# EAGLE design mippe_mod_test (EAGLE 9.5.2)
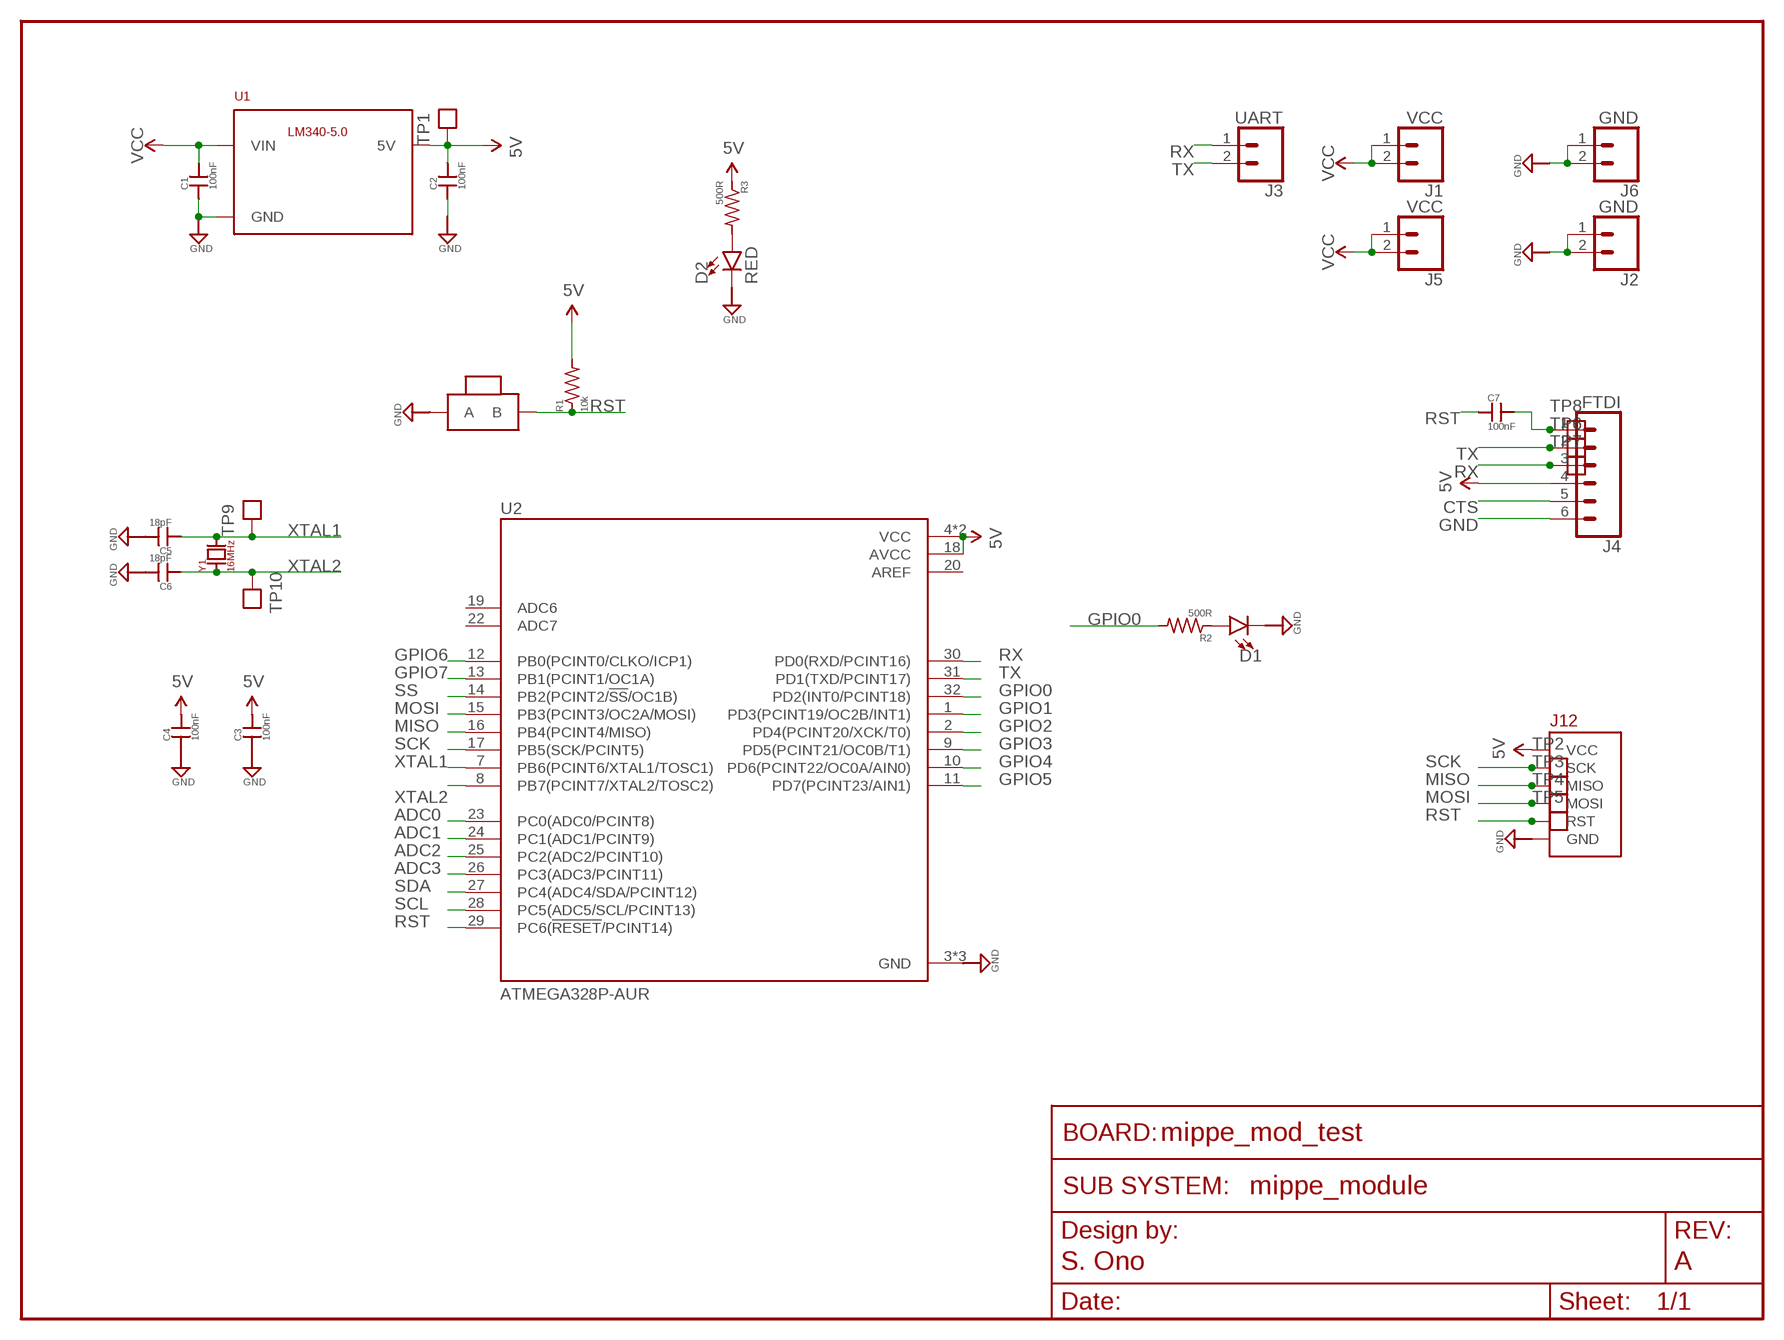
[diagram p0: schematic, sheet 1]
FRAME2 (FRAME_SCHEMATIC): AUTHOR: S. Ono; REV: A; SUBSYSTEM_NAME: mippe_module

## Parts
C1  100nF  CAP0402-CAP  [0402-CAP]
C2  100nF  CAP0402-CAP  [0402-CAP]
C3  100nF  CAP0402-CAP  [0402-CAP]
C4  100nF  CAP0402-CAP  [0402-CAP]
C5  18pF  CAP0402-CAP  [0402-CAP]
C6  18pF  CAP0402-CAP  [0402-CAP]
C7  100nF  CAP0402-CAP  [0402-CAP]
D1  LED0603  [LED-0603]
D2  RED  LED0603  [LED-0603]
J1  VCC  CONN_02  [1X02]
J2  GND  CONN_02  [1X02]
J3  UART  CONN_02  [1X02]
J4  FTDI  CONN_06NO_SILK_FEMALE_PTH  [1X06_NO_SILK]
J5  VCC  CONN_02  [1X02]
J6  GND  CONN_02  [1X02]
J12  BURNIN  [BURNIN]
R1  10k  R-US_R0402  [R0402]
R2  500R  R-US_R0402  [R0402]
R3  500R  R-US_R0402  [R0402]
SW1  BTN-PTS810  [BTN_PTS810]
TP1  TEST_POINTTHRU  [TEST_POINT]
TP2  TEST_POINTTHRU  [TEST_POINT]
TP3  TEST_POINTTHRU  [TEST_POINT]
TP4  TEST_POINTTHRU  [TEST_POINT]
TP5  TEST_POINTTHRU  [TEST_POINT]
TP6  TEST_POINTTHRU  [TEST_POINT]
TP7  TEST_POINTTHRU  [TEST_POINT]
TP8  TEST_POINTTHRU  [TEST_POINT]
TP9  TEST_POINTTHRU  [TEST_POINT]
TP10  TEST_POINTTHRU  [TEST_POINT]
U1  LM340MPX-5.0230  [SOT230P700X180-4N]
U2  ATMEGA328P-AUR  [QFP80P900X900X120-32N]
Y1  16MHz  CRYSTAL_SMOL  [XTAL500X320X130N]

## Nets
5V: C2.2 C3.2 C4.2 J4.4 J12.3.3V(VCC) R1.2 R3.1 TP1.1 U1.3(5V) U2.4(VCC) U2.6(VCC) U2.18(AVCC)
ADC0: U2.23(PC0(ADC0/PCINT8))
ADC1: U2.24(PC1(ADC1/PCINT9))
ADC2: U2.25(PC2(ADC2/PCINT10))
ADC3: U2.26(PC3(ADC3/PCINT11))
CTS: J4.5
GND: C1.1 C2.1 C3.1 C4.1 C5.2 C6.2 D1.C D2.C J2.1 J2.2 J4.6 J6.1 J6.2 J12.GND SW1.1(A) SW1.2(A) U1.2(GND) U1.4(GND) U2.3(GND) U2.5(GND) U2.21(GND)
GPIO0: R2.2 U2.32(PD2(INT0/PCINT18))
GPIO1: U2.1(PD3(PCINT19/OC2B/INT1))
GPIO2: U2.2(PD4(PCINT20/XCK/T0))
GPIO3: U2.9(PD5(PCINT21/OC0B/T1))
GPIO4: U2.10(PD6(PCINT22/OC0A/AIN0))
GPIO5: U2.11(PD7(PCINT23/AIN1))
GPIO6: U2.12(PB0(PCINT0/CLKO/ICP1))
GPIO7: U2.13(PB1(PCINT1/OC1A))
MISO: J12.MISO TP3.1 U2.16(PB4(PCINT4/MISO))
MOSI: J12.MOSI TP4.1 U2.15(PB3(PCINT3/OC2A/MOSI))
N$1: D1.A R2.1
N$2: D2.A R3.2
N$3: C7.2 J4.1 TP8.1
RST: C7.1 J12.RST R1.1 SW1.3(B) SW1.4(B) TP5.1 U2.29(PC6(!RESET!/PCINT14))
RX: J3.1 J4.3 TP7.1 U2.30(PD0(RXD/PCINT16))
SCK: J12.SCK TP2.1 U2.17(PB5(SCK/PCINT5))
SCL: U2.28(PC5(ADC5/SCL/PCINT13))
SDA: U2.27(PC4(ADC4/SDA/PCINT12))
SS: U2.14(PB2(PCINT2/!SS!/OC1B))
TX: J3.2 J4.2 TP6.1 U2.31(PD1(TXD/PCINT17))
VCC: C1.2 J1.1 J1.2 J5.1 J5.2 U1.1(VIN)
XTAL1: C5.1 TP9.1 U2.7(PB6(PCINT6/XTAL1/TOSC1)) Y1.2(B)
XTAL2: C6.1 TP10.1 U2.8(PB7(PCINT7/XTAL2/TOSC2)) Y1.1(A)
Unconnected: U2.19(ADC6) U2.22(ADC7)

## Power pins joined to a net without a drawn wire
AREF: U2.20(AREF)

## Library data of the parts
C1-C7 = scono:CAP: Capacitor Standard 0603 ceramic capacitor, and 0.1" leaded capacitor.; PIE-INT-REF-NUM: CAPACITOR-GENERIC
D1 D2 = scono:LED: https://www.digikey.com/products/en/optoelectronics/led-indication-discrete/105?k=&pkeyword=&pv7=2&pv1989=0&pv16=5&FV=ffe00069&quantity=0&ColumnSort=0&page=1&pageSize=25
J1-J3 J5 J6 = scono:CONN_02: Multi connection point. Often used as Generic Header-pin footprint for 0.1 inch spaced/style header connections On any of the 0.1 inch spaced packages, you can populate with these: Break Away Headers - Straight <https://www.sparkfun.com/products/116> (PRT-00116) Break Away Male Headers - Right Angle <https://www.sparkfun.com/products/553> (PRT-00553) Female Headers <https://www.sparkfun.com/products/115> (PRT-00115) Break Away Headers - Machine Pin <https://www.sparkfun.com/products/117> (PRT-00117) Break Away Female Headers - Swiss Machine Pin <https://www.sparkfun.com/products/743> (PRT-00743) For SCREWTERMINALS and SPRING TERMINALS visit here: Screw Terimnals on SparkFun.com <https://www.sparkfun.com/search/results?term=Screw+Terminals> (5mm/3.5mm/2.54mm spacing) This device is also useful as a general connection point to wire up your design to another part of your project. Our various solder wires solder well into these plated through hole pads. Hook-Up Wire - Assortment (Stranded, 22 AWG) <https://www.sparkfun.com/products/11375> (PRT-11375) Hook-Up Wire - Assortment (Solid Core, 22 AWG) <https://www.sparkfun.com/products/11367> (PRT-11367) View the entire wire category on our website here <https://www.sparkfun.com/categories/141> Special notes: Molex polarized connector foot print use with: PRT-08233 with associated crimp pins and housings. 2.54_SCREWTERM for use with PRT-10571. 3.5mm Screw Terminal footprints for PRT-08084 5mm Screw Terminal footprints for use with PRT-08432
J4 = scono:CONN_06: Multi connection point. Often used as Generic Header-pin footprint for 0.1 inch spaced/style header connections On any of the 0.1 inch spaced packages, you can populate with these: Break Away Headers - Straight <https://www.sparkfun.com/products/116> (PRT-00116) Break Away Male Headers - Right Angle <https://www.sparkfun.com/products/553> (PRT-00553) Female Headers <https://www.sparkfun.com/products/115> (PRT-00115) Break Away Headers - Machine Pin <https://www.sparkfun.com/products/117> (PRT-00117) Break Away Female Headers - Swiss Machine Pin <https://www.sparkfun.com/products/743> (PRT-00743) Arduino Stackable Header - 6 Pin <https://www.sparkfun.com/products/9280> (PRT-09280) For SCREWTERMINALS and SPRING TERMINALS visit here: Screw Terimnals on SparkFun.com <https://www.sparkfun.com/search/results?term=Screw+Terminals> (5mm/3.5mm/2.54mm spacing) This device is also useful as a general connection point to wire up your design to another part of your project. Our various solder wires solder well into these plated through hole pads. Hook-Up Wire - Assortment (Stranded, 22 AWG) <https://www.sparkfun.com/products/11375> (PRT-11375) Hook-Up Wire - Assortment (Solid Core, 22 AWG) <https://www.sparkfun.com/products/11367> (PRT-11367) View the entire wire category on our website here <https://www.sparkfun.com/categories/141>; PROD_ID: CONN-08437
J12 = scono:BURNIN
R1-R3 = scono:R-US_: RESISTOR, American symbol
SW1 = scono:BTN-PTS810: https://www.digikey.com/product-detail/en/c-k/PTS810-SJM-250-SMTR-LFS/CKN10502CT-ND/4176673
TP1-TP10 = scono:TEST_POINT: 1206 Test point for O-scope probes. For A106146CT-ND or similar
U1 = scono:LM340MPX-5.0
U2 = scono:ATMEGA328P-AUR: ATmega328P Series 8 Bit 2 kB RAM 32 kB Flash SMT Microcontroller - TQFP-32; DESCRIPTION: ATmega328P Series 8 Bit 2 kB RAM 32 kB Flash SMT Microcontroller - TQFP-32; DIGI-KEY_PART_NUMBER: ATMEGA328P-AURCT-ND; DIGI-KEY_PURCHASE_URL: https://www.digikey.com/product-detail/en/microchip-technology/ATMEGA328P-AUR/ATMEGA328P-AURCT-ND/3789455?utm_source=snapeda&utm_medium=aggregator&utm_campaign=symbol; MF: Microchip; MP: ATMEGA328P-AUR; PACKAGE: TQFP-32 Microchip
Y1 = scono:CRYSTAL

## Board
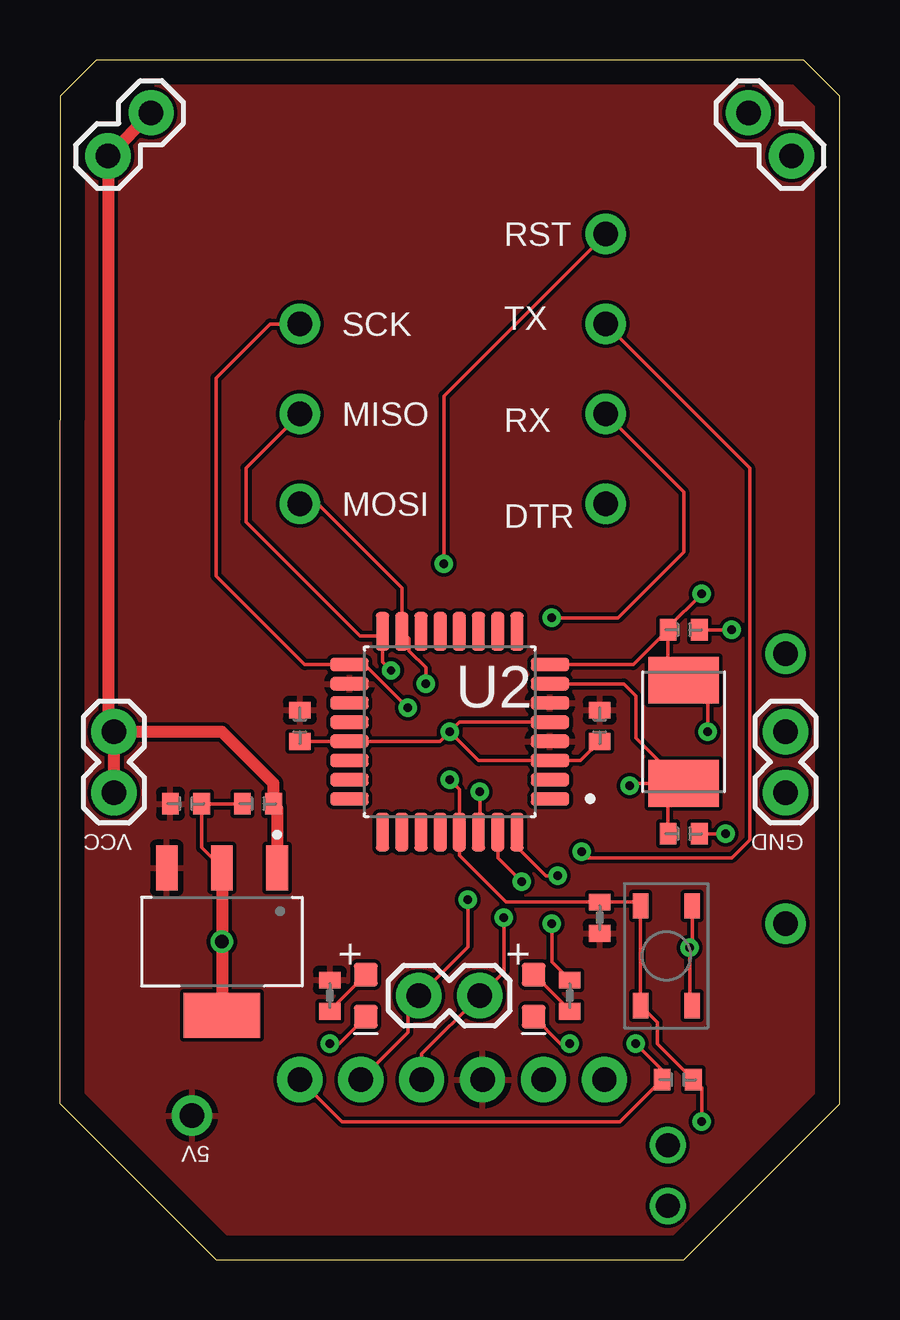
[diagram p1: board, top side]
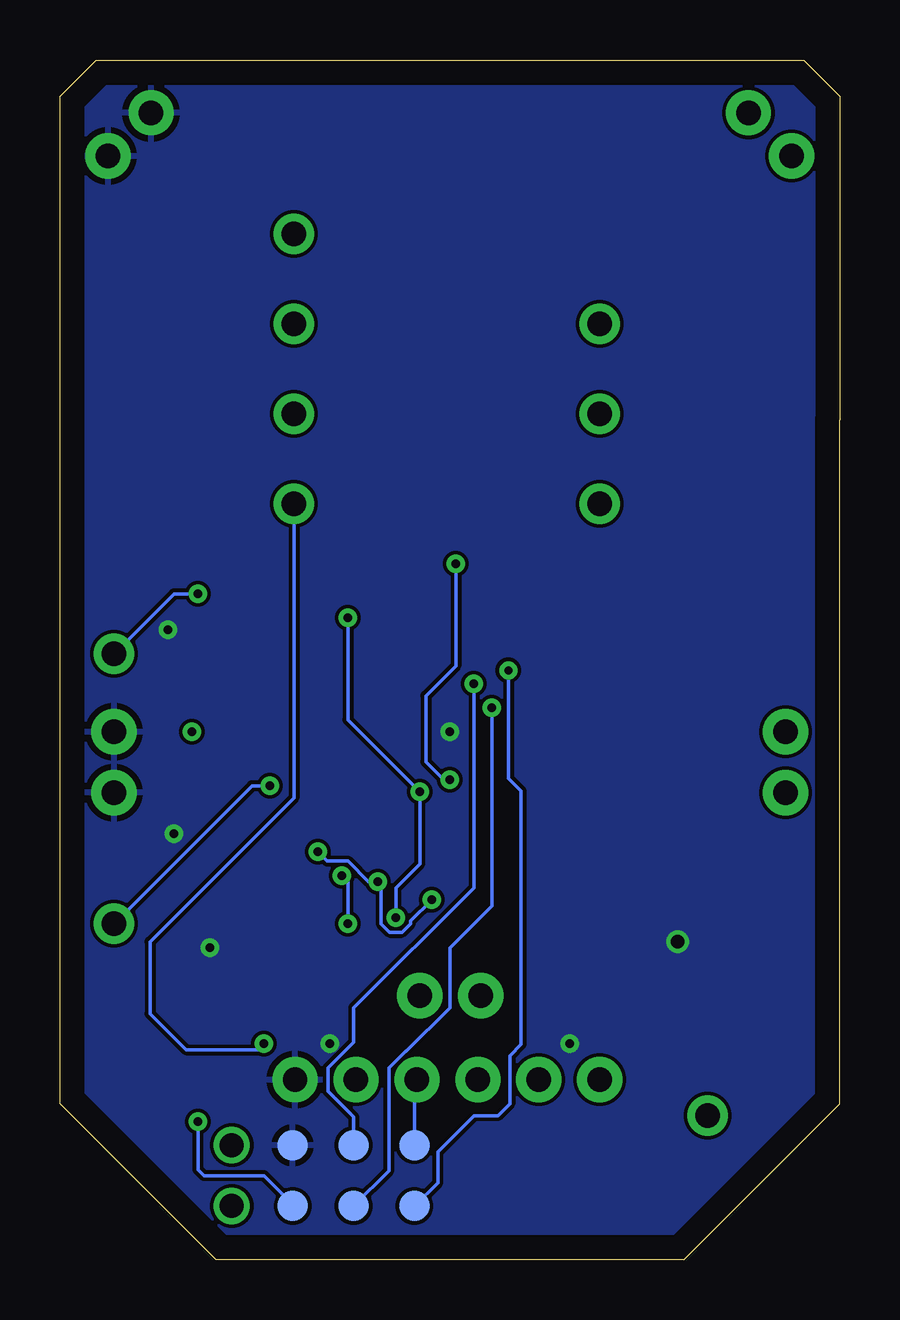
[diagram p2: board, bottom side, seen from below]

Size 32.5 x 50 mm. Coordinates in mm from the lower left corner, seen from the top.
Outline: 6.5,0 0,6.5 0,35 0,48.5 1.5,50 31,50 32.5,48.5 32.5,30.5 32.5,6.5 26,0 6.5,0
Copper layers (1*16): Top 0.035mm / dielectric 0.15mm / Bottom 0.035mm
Design rules "default": minimum track width 6mil, minimum drill 0.35mm, track to track 6mil, track to pad 6mil, pad to pad 6mil, via to via 6mil, smd to smd 6mil, copper to edge 40mil, drill to drill 6mil, minimum pad ring 10mil, minimum via ring 8mil, stop-mask expansion 4mil, vias tented up to drill 0mil, thermal gap 10mil

### Footprints (pad centres in the part's own frame; a part is rotated, then mirrored left to right if it is on the bottom)
0402-CAP = smd 0.7 x 0.9: 1 -0.65,0; 2 0.65,0
LED-0603 = smd 1 x 1: A 0.877,0; C -0.877,0
1X02 = drill 1.016 pad 1.88: 1 0,0; 2 2.54,0
1X06_NO_SILK = drill 1.016 pad 1.88: 1 0,0; 2 2.54,0; 3 5.08,0; 4 7.62,0; 5 10.16,0; 6 12.7,0
BURNIN = smd 1.27 x 1.27 bottom: 3.3V 0,0; GND -5.08,0; MISO 0,2.54; MOSI -2.54,0; RST -5.08,2.54; SCK -2.54,2.54 | drill 1: P$7 -7.62,2.54; P$8 -7.62,0
R0402 = smd 0.7 x 0.9: 1 -0.65,0; 2 0.65,0
BTN_PTS810 = smd 1.05 x 0.65: 1 -2.075,1.075; 2 2.075,1.075; 3 -2.075,-1.075; 4 2.075,-1.075
TEST_POINT = drill 1.016 pad 1.676: 1 0,0
SOT230P700X180-4N = smd 1.86 x 0.9: 1 -3.075,2.3; 2 -3.075,0; 3 -3.075,-2.3 | smd 1.86 x 3.19: 4 3.075,0
QFP80P900X900X120-32N = smd 1.6 x 0.55: 1 -4.18,2.8; 2 -4.18,2; 3 -4.18,1.2; 4 -4.18,0.4; 5 -4.18,-0.4; 6 -4.18,-1.2; 7 -4.18,-2; 8 -4.18,-2.8; 17 4.18,-2.8; 18 4.18,-2; 19 4.18,-1.2; 20 4.18,-0.4; 21 4.18,0.4; 22 4.18,1.2; 23 4.18,2; 24 4.18,2.8 | smd 0.55 x 1.6: 9 -2.8,-4.18; 10 -2,-4.18; 11 -1.2,-4.18; 12 -0.4,-4.18; 13 0.4,-4.18; 14 1.2,-4.18; 15 2,-4.18; 16 2.8,-4.18; 25 2.8,4.18; 26 2,4.18; 27 1.2,4.18; 28 0.4,4.18; 29 -0.4,4.18; 30 -1.2,4.18; 31 -2,4.18; 32 -2.8,4.18
XTAL500X320X130N = smd 1.95 x 2.95: 1 -2.15,0; 2 2.15,0

### Placement (x,y rotation side)
C1  8.25,19 0 top
C2  5.25,19 180 top
C3  10,22.25 90 top
C4  22.5,22.25 90 top
C5  26,17.75 0 top
C6  26,26.25 0 top
C7  25.75,7.5 180 top
D1  19.75,11 90 top
D2  12.75,11 90 top
J1  2.25,22 270 top
J2  30.25,22 270 top
J3  17.5,11 180 top
J4  10,7.5 0 top
J5  2,46 45 top
J6  30.5,46 135 top
J12  17.72,4.77 180 top
R1  22.5,14.25 270 top
R2  21.25,11 90 top
R3  11.25,11 270 top
SW1  25.28,12.66 270 top
TP1  5.5,6 0 top
TP2  10,39 0 top
TP3  10,35.25 0 top
TP4  10,31.5 0 top
TP5  22.75,42.75 0 top
TP6  22.75,39 0 top
TP7  22.75,35.25 0 top
TP8  22.75,31.5 0 top
TP9  30.25,14 0 top
TP10  30.25,25.25 0 top
U1  6.75,13.25 270 top
U2  16.25,22 180 top
Y1  26,22 270 top

### Tracks (layer width: path | path; a pad name or v marks a point on that pad's centre or on a via)
5V
  Bottom 0.152: J12.3.3V 17.72,7.4 J4.4
  pour Top: 36.75,-1.25 -7.75,-1.25 -7.75,50.75 36.75,50.75
GND  (via drill 0.35, 0.55)
  Top 0.152: U1.2 5.9,17.18 C2.1 C1.1 | C3.1 U2.21 15.85,21.6 v16.25,22 | C6.2 v28,26.25 | C4.1 21.7,20.8 U2.3 17.45,20.8 v16.25,22 | U2.5 16.65,22.4 v16.25,22 | C5.2 v27.75,17.75 | SW1.1 26.36,13.11 v26.25,13 26.25,10.69 SW1.2 | D1.C 20.87,9 v21.25,9 | D2.C 11.63,9 v11.25,9
  Top 0.508: U1.2 v6.75,13.25 U1.4
  pour Bottom: 36.75,-1.25 -7.75,-1.25 -7.75,50.75 36.75,50.75
GPIO0  (via drill 0.35)
  Top 0.152: R2.2 20.5,12.4 v20.5,14 | v20.75,16 20.25,16 19.05,17.2 U2.32
  Bottom 0.152: v20.5,14 20.5,15.75 v20.75,16
MISO  (via drill 0.35)
  Top 0.152: U2.16 13.45,26 | 13.45,26 13.45,24.91 v13.8,24.55 | TP3.1 7.75,33 7.75,30.75 12.5,26 13.45,26
  Bottom 0.152: v13.8,24.55 13.8,20.05 13.38,19.62 13.28,19.53 13.28,8.97 13.75,8.5 13.75,6.5 14.25,6 15.25,6 16.75,4.5 16.75,3.2 J12.MISO
MOSI  (via drill 0.35)
  Top 0.152: v15.25,24 15.25,24.67 14.55,25.37 14.55,25.88 U2.15 14.25,28 10.75,31.5 TP4.1
  Bottom 0.152: J12.MOSI 20.26,5.95 21.33,7.02 21.33,7.98 20.26,9.05 20.26,10.49 15.25,15.5 v15.25,24
N$1
  Top 0.152: D1.A 21.25,10.38 R2.1
N$2
  Top 0.152: D2.A 11.25,10.38 R3.2
N$3  (via drill 0.35)
  Top 0.152: J4.1 11.75,5.75 23.35,5.75 C7.2 25.1,7.9 v24,9
  Bottom 0.152: v24,9 24.25,8.75 27.25,8.75 28.75,10.25 28.75,13.25 22.75,19.25 TP8.1
RST  (via drill 0.35)
  Top 0.152: 24.09,14.85 24.04,14.9 R1.1 18.6,14.9 16.65,16.85 16.65,17.5 U2.29 16.65,19.6 v16.25,20 | 24.09,14.85 SW1.3 | SW1.3 SW1.4 24.9,9.89 24.9,9 C7.1 26.75,7.15 v26.75,5.75 | SW1.3 24.09,14.85 | TP5.1 16,36 v16,29
  Bottom 0.152: J12.RST 22.8,2.3 24,3.5 26.5,3.5 26.75,3.75 v26.75,5.75 | v16,29 16,24.75 17.25,23.5 17.25,20.75 16.5,20 v16.25,20
RX  (via drill 0.35)
  Top 0.152: v17.5,19.5 17.5,17.87 U2.30 | v18.5,14.25 18.5,12 J3.1 15.08,8.58 J4.3 | TP7.1 26,32 26,29.5 23.25,26.75 v20.5,26.75
  Bottom 0.152: v18.5,14.25 18.5,15.5 17.5,16.5 v17.5,19.5 20.5,22.5 v20.5,26.75
SCK  (via drill 0.35)
  Top 0.152: v14.5,23 12.7,24.8 U2.17 10.2,24.8 6.5,28.5 6.5,36.75 8.75,39 TP2.1
  Bottom 0.152: J12.SCK 18.79,3.7 18.79,7.98 18.1,8.67 18.08,8.67 16.25,10.5 16.25,13 14.5,14.75 v14.5,23
TX  (via drill 0.35)
  Top 0.152: v19.25,15.75 18.25,16.75 U2.31 | J4.2 14.5,9.46 14.5,10.54 J3.2 17,13.04 v17,15 | TP6.1 28.75,33 28.75,17.5 28,16.75 22,16.75 v21.75,17
  Bottom 0.152: v17,15 17.89,14.11 17.89,14 18.25,13.64 18.75,13.64 19.11,14 19.11,15.61 v19.25,15.75 19.64,15.75 20.5,16.61 21.36,16.61 v21.75,17
VCC
  Top 0.508: U1.1 9.05,18.85 C1.2 8.9,19.85 6.75,22 J1.1 | J1.2 J1.1 | J5.2 J5.1 2,22.25 J1.1
XTAL1  (via drill 0.35)
  Top 0.152: U2.7 23.5,24 24,23.5 24,21.75 25.9,19.85 Y1.2 | C5.1 25.35,19.2 Y1.2 | Y1.2 23.85,19.85 v23.75,19.75
  Bottom 0.152: v23.75,19.75 24.5,19.75 TP9.1
XTAL2  (via drill 0.35)
  Top 0.152: C6.1 23.9,24.8 U2.8 | C6.1 25.35,24.8 Y1.1 27,23.15 v27,22 | C6.1 25.35,26.35 v26.75,27.75
  Bottom 0.152: v26.75,27.75 27.75,27.75 TP10.1

### Text on the board
tPlace: RST | TX | SCK | MISO | RX | MOSI | DTR | VCC | GND
tNames: U2 | 5V